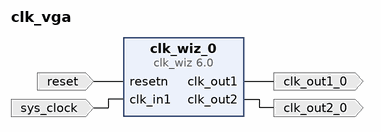
[diagram p0: block diagram of the top level]
# Vivado block design clk_vga, xc7a35tcpg236-1, Vivado 2025.2
create_bd_design clk_vga

create_bd_port -dir I -type clk sys_clock
set_property -dict {CONFIG.FREQ_HZ 100000000 CONFIG.PHASE 0.0} [get_bd_ports sys_clock]
create_bd_port -dir I -type rst reset
set_property -dict {CONFIG.POLARITY ACTIVE_LOW} [get_bd_ports reset]
create_bd_port -dir O -type clk clk_out1_0
create_bd_port -dir O -type clk clk_out2_0

create_bd_cell -type ip -vlnv xilinx.com:ip:clk_wiz:6.0 clk_wiz_0
set_property -dict [list \
  CONFIG.CLKOUT1_JITTER 198.342 \
  CONFIG.CLKOUT1_PHASE_ERROR 130.058 \
  CONFIG.CLKOUT1_REQUESTED_OUT_FREQ 25.127 \
  CONFIG.CLKOUT2_JITTER 227.881 \
  CONFIG.CLKOUT2_PHASE_ERROR 130.058 \
  CONFIG.CLKOUT2_REQUESTED_OUT_FREQ 12.500 \
  CONFIG.CLKOUT2_USED true \
  CONFIG.CLK_IN1_BOARD_INTERFACE sys_clock \
  CONFIG.MMCM_CLKFBOUT_MULT_F 6.125 \
  CONFIG.MMCM_CLKOUT0_DIVIDE_F 24.375 \
  CONFIG.MMCM_CLKOUT1_DIVIDE 49 \
  CONFIG.MMCM_DIVCLK_DIVIDE 1 \
  CONFIG.NUM_OUT_CLKS 2 \
  CONFIG.RESET_BOARD_INTERFACE reset \
  CONFIG.RESET_PORT resetn \
  CONFIG.RESET_TYPE ACTIVE_LOW \
  CONFIG.USE_BOARD_FLOW true \
  CONFIG.USE_LOCKED false \
] [get_bd_cells clk_wiz_0]

# ---- connections ----

connect_bd_net [get_bd_pins clk_wiz_0/clk_out1] [get_bd_ports clk_out1_0]
connect_bd_net [get_bd_pins clk_wiz_0/clk_out2] [get_bd_ports clk_out2_0]
connect_bd_net [get_bd_ports reset] [get_bd_pins clk_wiz_0/resetn]
connect_bd_net [get_bd_ports sys_clock] [get_bd_pins clk_wiz_0/clk_in1]

validate_bd_design
save_bd_design
